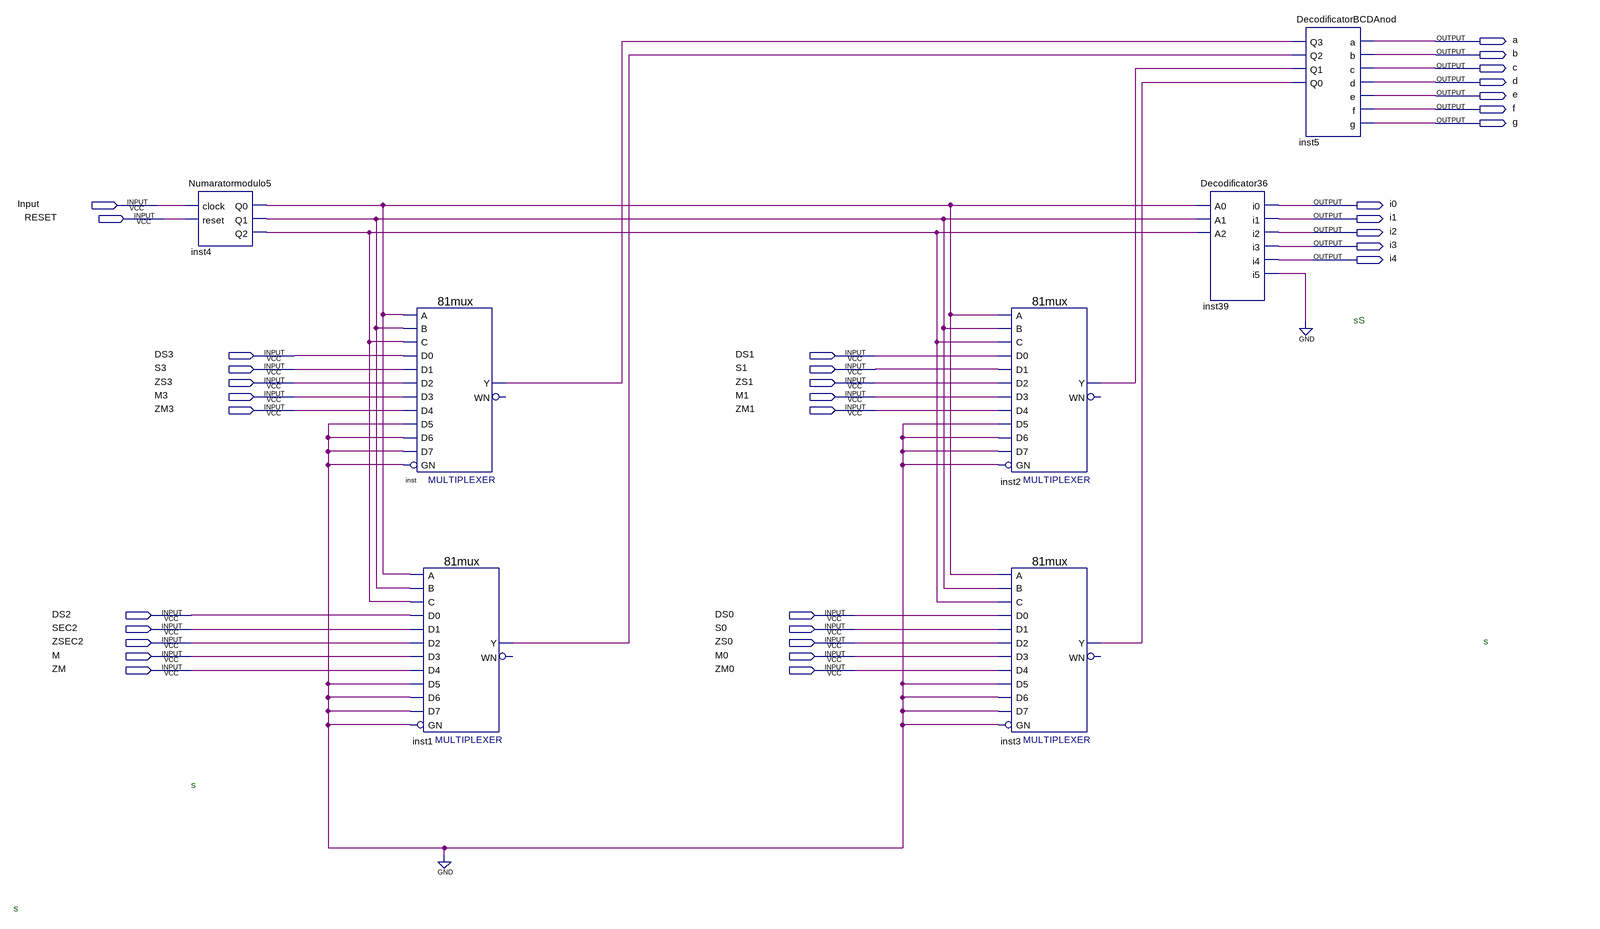
[diagram p0: schematic sheet]
// Quartus schematic AfisareMux.bdf as structural Verilog: 7 symbols, 34 pins
module AfisareMux (
  input  Input,
  input  RESET,
  input  DS3,
  input  DS1,
  input  S3,
  input  S1,
  input  ZS3,
  input  ZS1,
  input  M3,
  input  M1,
  input  ZM3,
  input  ZM1,
  input  DS2,
  input  DS0,
  input  SEC2,
  input  S0,
  input  ZSEC2,
  input  ZS0,
  input  M,
  input  M0,
  input  ZM,
  input  ZM0,
  output a,
  output b,
  output c,
  output d,
  output e,
  output f,
  output g,
  output i0,
  output i1,
  output i2,
  output i3,
  output i4
);

  wire inst1_y, inst2_y, inst3_y, inst4_q0, inst4_q1, inst4_q2, inst39_i5, inst_y;

  Numaratormodulo5 inst4 (.clock(Input), .reset(RESET), .Q0(inst4_q0), .Q1(inst4_q1), .Q2(inst4_q2));
  \81mux  inst (
    .C(inst4_q2), .D1(S3), .D0(DS3), .D5(1'b0), .D4(ZM3), .D2(ZS3), .D3(M3), .GN(1'b0), .D7(1'b0), .D6(1'b0),
    .A(inst4_q0), .B(inst4_q1), .Y(inst_y));  // open: WN
  \81mux  inst1 (
    .C(inst4_q2), .D1(SEC2), .D0(DS2), .D5(1'b0), .D4(ZM), .D2(ZSEC2), .D3(M), .GN(1'b0), .D7(1'b0),
    .D6(1'b0), .A(inst4_q0), .B(inst4_q1), .Y(inst1_y));  // open: WN
  \81mux  inst2 (
    .C(inst4_q2), .D1(S1), .D0(DS1), .D5(1'b0), .D4(ZM1), .D2(ZS1), .D3(M1), .GN(1'b0), .D7(1'b0), .D6(1'b0),
    .A(inst4_q0), .B(inst4_q1), .Y(inst2_y));  // open: WN
  \81mux  inst3 (
    .C(inst4_q2), .D1(S0), .D0(DS0), .D5(1'b0), .D4(ZM0), .D2(ZS0), .D3(M0), .GN(1'b0), .D7(1'b0), .D6(1'b0),
    .A(inst4_q0), .B(inst4_q1), .Y(inst3_y));  // open: WN
  Decodificator36 inst39 (
    .A0(inst4_q0), .A1(inst4_q1), .A2(inst4_q2), .i0(i0), .i1(i1), .i2(i2), .i3(i3), .i4(i4), .i5(inst39_i5));
  DecodificatorBCDAnod inst5 (
    .Q3(inst_y), .Q2(inst1_y), .Q1(inst2_y), .Q0(inst3_y), .a(a), .b(b), .c(c), .d(d), .e(e), .f(f), .g(g));
  // also tied to GND on the sheet: inst39_i5

  // Notes on the sheet:
  //   sS
  //   s
  //   s
  //   s
endmodule
